# Altium schematic sheet USB and CAN. Page 6.SchDoc
size 420 x 297 mm; Address1: Address1; Address2: Address2; Address3: Address3; Address4: Address4; DocumentNumber: АБВГ.123456.001 Э3; SheetNumber: 6; SheetTotal: 7; Scale: 1:1; DocumentType: Схема электрическая принципиальная; FirstReferrence: АБВГ.123456.001
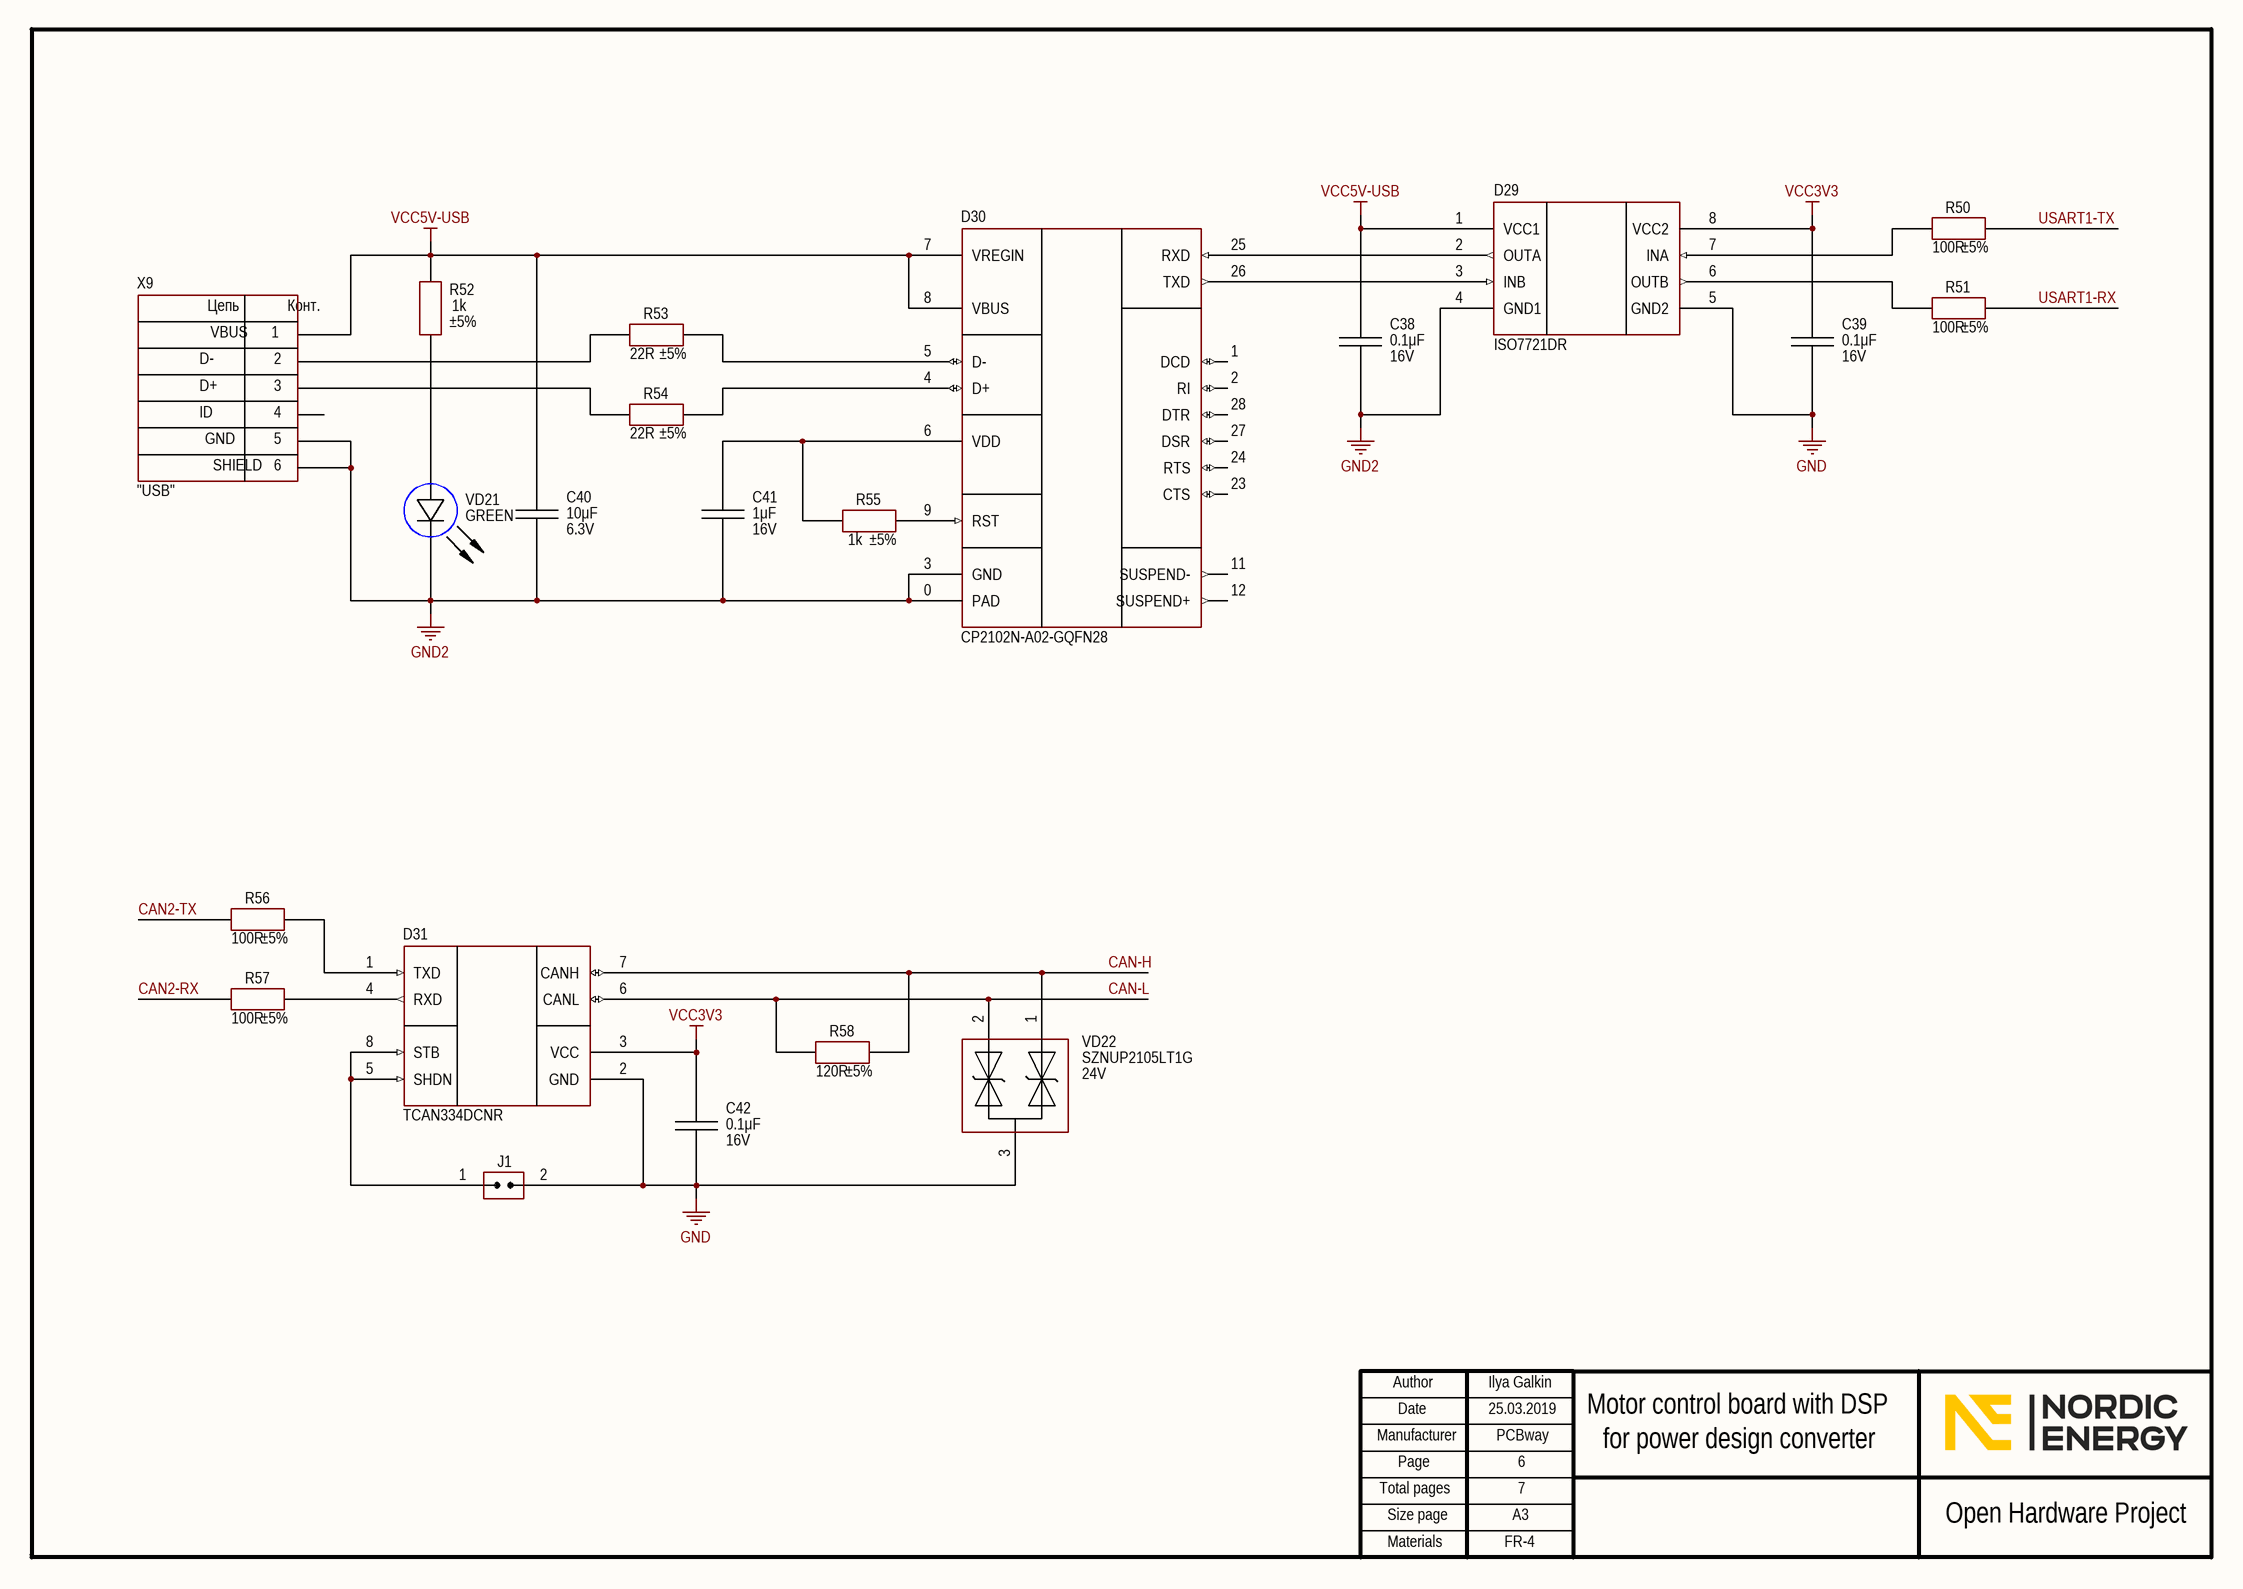
[diagram p0: USB and CAN. Page 6.SchDoc]

## Parts
C38  value 0.1μF  Voltage: 16V  [CAP: 0805]
C39  value 0.1μF  Voltage: 16V  [CAP: 0805]
C40  value 10μF  Voltage: 6.3V  [CAP: 0805]
C41  value 1μF  Voltage: 16V  [CAP: 0805]
C42  value 0.1μF  Voltage: 16V  [CAP: 0805]
D29  (no value)  [8-SOIC]
D30  PartNumber: CP2102N-A02-GQFN28  [28-QFN (5x5)]
D31  (no value)  [SOT23-8]
J1  (no value)  [CON: JUMPER x1]
R50  value 100R  Tolerance: ±5%  [RES: 0805]
R51  value 100R  Tolerance: ±5%  [RES: 0805]
R52  value 1k  Tolerance: ±5%  [RES: 0805]
R53  value 22R  Tolerance: ±5%  [RES: 0805]
R54  value 22R  Tolerance: ±5%  [RES: 0805]
R55  value 1k  Tolerance: ±5%  [RES: 0805]
R56  value 100R  Tolerance: ±5%  [RES: 0805]
R57  value 100R  Tolerance: ±5%  [RES: 0805]
R58  value 120R  Tolerance: ±5%  [RES: 0805]
VD21  Color: GREEN  [LED: 0603G]
VD22  Voltage: 24V  PartNumber: SZNUP2105LT1G  [SOT23]
X9  CommentText: "USB"  [CON: USB micro-A (ZX62-B-5PA)]

## Nets
GND: C39.1 C42.1 D29.5(GND2) D31.2(GND) J1.2(IN) VD22.3
GND2: C38.1 C40.1 C41.1 D29.4(GND1) D30.0(PAD) D30.3(GND) VD21.2(C) X9.0 X9.5
VCC3V3: C39.2 C42.2 D29.8(VCC2) D31.3(VCC)
VCC5V-USB: C38.2 C40.2 D29.1(VCC1) D30.7(VREGIN) D30.8(VBUS) R52.2 X9.1
CAN2-RX: R57.1
CAN2-TX: R56.1
CAN-H: D31.7(CANH) R58.2 VD22.1
CAN-L: D31.6(CANL) R58.1 VD22.2
USART1-RX: R51.2
USART1-TX: R50.2
NetC41_2: C41.2 D30.6(VDD) R55.2
NetD29_2: D29.2(OUTA) D30.25(RXD)
NetD29_3: D29.3(INB) D30.26(TXD)
NetD29_6: D29.6(OUTB) R51.1
NetD29_7: D29.7(INA) R50.1
NetD30_4: D30.4(D+) R54.2
NetD30_5: D30.5(D-) R53.2
NetD30_9: D30.9(RST) R55.1
NetD31_1: D31.1(TXD) R56.2
NetD31_4: D31.4(RXD) R57.2
NetD31_5: D31.5(SHDN) D31.8(STB) J1.1(IN)
NetR52_1: R52.1 VD21.1(A)
NetR53_1: R53.1 X9.2
NetR54_1: R54.1 X9.3

Not connected (* = marked no-connect by the designer): D30 1(DCD) 2(RI) 11(SUSPEND-) 12(SUSPEND+) 23(CTS) 24(RTS) 27(DSR) 28(DTR); X9 4

## Notes on the sheet
- Ilya Galkin
- 25.03.2019
- PCBway
- 6
- Motor control board with DSP
- for power design converter
- 7
- FR-4
- Author
- Manufacturer
- Date
- Page
- Total pages
- Size page
- A3
- Open Hardware Project
- Materials
- (in symbol Connector_USB_micro_B) Цепь; Конт.; VBUS; D-; D+; ID; GND; SHIELD; 6

## Library data of the parts
C38 C39 C42 = Ceramic_0805: Manufacturer: Yageo; PartNumber: CC0805KRX7R7BB104; ValueManufacturerPartNumber: Ceramic capacitor, 0.1μF, X7R, ±10%, 16V, 0805, -55...+125°C; TypeCapacitor: Ceramic capacitor; Tolerance: ±10%; TypeDielectric: X7R; Package: 0805; HelpURL: https://www.digikey.com/product-detail/en/yageo/CC0805KRX7R7BB104/311-1142-1-ND/303052; Temperature: -55...+125°C
C40 = Ceramic_0805: Manufacturer: Samsung; PartNumber: CL21B106KQQNNNE; ValueManufacturerPartNumber: Ceramic capacitor, 10μF, X7R, ±10%, 6.3V, 0805, -55...+125°C; TypeCapacitor: Ceramic capacitor; Tolerance: ±10%; TypeDielectric: X7R; Package: 0805; HelpURL: https://www.digikey.com/product-detail/en/samsung-electro-mechanics/CL21B106KQQNNNE/1276-1113-1-ND/3889199; Temperature: -55...+125°C
C41 = Ceramic_0805: Manufacturer: Yageo; PartNumber: CC0805KKX7R7BB105; ValueManufacturerPartNumber: Ceramic capacitor, 1μF, X7R, ±10%, 16V, 0805, -55...+125°C; TypeCapacitor: Ceramic capacitor; Tolerance: ±10%; TypeDielectric: X7R; Package: 0805; HelpURL: https://www.digikey.com/product-detail/en/yageo/CC0805KKX7R7BB105/311-1365-1-ND/2103149; Temperature: -55...+125°C
D29 = ISO7721DR: Digital isolator; Manufacturer: Texas Instruments; ValueManufacturerPartNumber: IC digital isolator, 100Mbps, 3000Vrms, 2.25...5.5V, -55...+125°C, 8-SOIC; Supply: 2.25...5.5V; DataRate: 100Mbps; Isolation: 3000Vrms; HelpURL: https://www.digikey.com/product-detail/en/texas-instruments/ISO7721DR/296-48296-1-ND/8347715; Package: 8-SOIC; ComponentType: IC digital isolator; Temperature: -55...+125°C; PartNumber: ISO7721DR
D30 = CP2102N: USB-to-UART; Manufacturer: Silicon Labs; ValueManufacturerPartNumber: IC usb-to-uart bridge, USB2.0, 3...3.6V, -40...+85°C, 28-VFQFN; Supply: 3...3.6V; HelpURL: https://www.digikey.com/product-detail/en/silicon-labs/CP2102N-A02-GQFN28/336-5889-ND/9863477; Package: 28-VFQFN; ComponentType: IC usb-to-uart bridge; Temperature: -40...+85°C; Standard: USB2.0
D31 = TCAN334DCNR: CAN; Manufacturer: Texas Instruments; ValueManufacturerPartNumber: IC CAN transceiver, 1Mbps, Half-duplex, 3...3.6V, -40...+125°C, SOT23-8; Supply: 3...3.6V; DataRate: 1Mbps; TypeDuplex: Half-duplex; HelpURL: https://www.digikey.com/product-detail/en/texas-instruments/TCAN334DCNR/296-47830-1-ND/8133179; Package: SOT23-8; ComponentType: IC CAN transceiver; Temperature: -40...+125°C; PartNumber: TCAN334DCNR
J1 = Jumper_single: CommentText: "Перемычка"
R50 R51 R56 R57 = Resistor_0805: Manufacturer: Yageo; PartNumber: RC0805JR-07100RL; ValueManufacturerPartNumber: Resistor film, 100R, ±5%, 0805, 0.125W, -55...+125°C; TypeResistor: Resistor film; Power: 0.125W; Package: 0805; HelpURL: https://www.digikey.com/product-detail/en/yageo/RC0805JR-07100RL/311-100ARCT-ND/731185; Temperature: -55...+125°C
R52 R55 = Resistor_0805: Manufacturer: Yageo; PartNumber: RC0805JR-071KL; ValueManufacturerPartNumber: Resistor film, 1k, ±5%, 0805, 0.125W, -55...+125°C; TypeResistor: Resistor film; Power: 0.125W; Package: 0805; HelpURL: https://www.digikey.com/product-detail/en/yageo/RC0805JR-071KL/311-1.0KARCT-ND/731165; Temperature: -55...+125°C
R53 R54 = Resistor_0805: Manufacturer: Yageo; PartNumber: RC0805JR-0722RL; ValueManufacturerPartNumber: Resistor film, 22R, ±5%, 0805, 0.125W, -55...+125°C; TypeResistor: Resistor film; Power: 0.125W; Package: 0805; HelpURL: https://www.digikey.com/product-detail/en/yageo/RC0805JR-0722RL/311-22ARCT-ND/731232; Temperature: -55...+125°C
R58 = Resistor_0805: Manufacturer: Yageo; PartNumber: RC0805JR-07120RL; ValueManufacturerPartNumber: Resistor film, 120R, ±5%, 0805, 0.125W, -55...+125°C; TypeResistor: Resistor film; Power: 0.125W; Package: 0805; HelpURL: https://www.digikey.com/product-detail/en/yageo/RC0805JR-07120RL/311-120ARCT-ND/731194; Temperature: -55...+125°C
VD21 = LED_single: Manufacturer: Wurth; ValueManufacturerPartNumber: LED, 20mA, 2V, 0805, -55...+150°C; PartNumber: 150080VS75000; TypeDiode: LED; Current: 20mA; VoltageDrop: 2V; Package: 0805; HelpURL: https://www.digikey.com/product-detail/en/wurth-electronics-inc/150080VS75000/732-4986-1-ND/4489922; Temperature: -55...+150°C
VD22 = TVS_array: Manufacturer: ON Semiconductor; ValueManufacturerPartNumber: Zener diode, 24V, 350W peak, 30pF, 17Ohm, SOT-23, -55...+150°C; TypeDiode: Zener diode; Current: 350W peak; VoltageDrop: 30pF; RecoveryTime: 17Ohm; Package: SOT-23; HelpURL: https://www.digikey.com/product-detail/en/on-semiconductor/SZNUP2105LT1G/SZNUP2105LT1GOSCT-ND/3487669; Temperature: -55...+150°C
X9 = Connector_USB_micro_B: Manufacturer: Hirose Electric; ValueManufacturerPartNumber: USB micro B; PartNumber: ZX62-B-5PA; HelpURL: https://www.digikey.com/product-detail/en/hirose-electric-co-ltd/ZX62-B-5PA/H11579CT-ND/1851090; TypeConnector: USB micro B